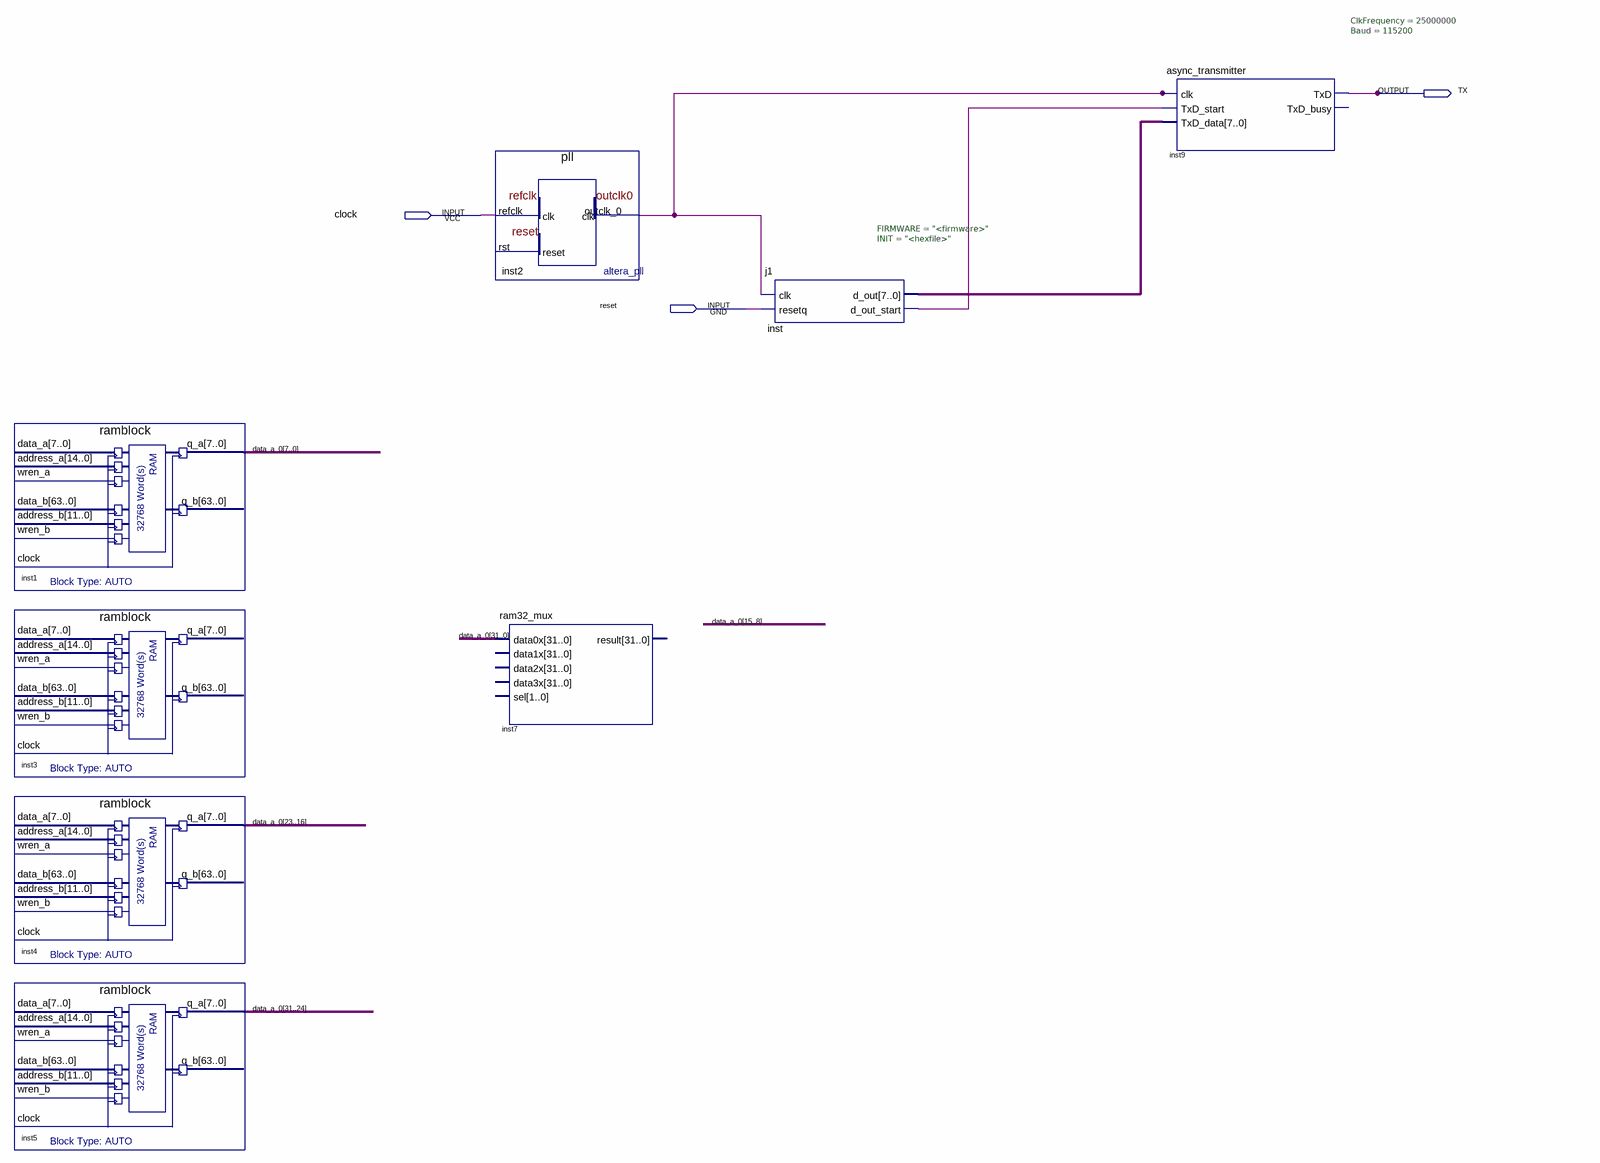
[diagram p0: schematic sheet]
// Quartus schematic top.bdf as structural Verilog: 8 symbols, 3 pins
module top (
  input  clock,
  input  reset,
  output TX
);

  wire inst2_outclk_0, inst_d_out_start;
  wire [7:0] inst_d_out;
  wire [31:0] data_a_0;

  ramblock inst1 (.q_a(data_a_0[7:0]));  // open: data_a, address_a, wren_a, data_b, address_b, wren_b, clock, q_b
  ramblock inst3 ();  // open: data_a, address_a, wren_a, data_b, address_b, wren_b, clock, q_a, q_b
  ramblock inst4 (.q_a(data_a_0[23:16]));  // open: data_a, address_a, wren_a, data_b, address_b, wren_b, clock, q_b
  ramblock inst5 (.q_a(data_a_0[31:24]));  // open: data_a, address_a, wren_a, data_b, address_b, wren_b, clock, q_b
  pll inst2 (.refclk(clock), .outclk_0(inst2_outclk_0));  // open: rst
  ram32_mux inst7 (.data0x(data_a_0));  // open: data1x, data2x, data3x, sel, result
  j1 #(.FIRMWARE("<firmware>"), .INIT("<hexfile>")) inst (
    .clk(inst2_outclk_0), .resetq(reset), .d_out(inst_d_out), .d_out_start(inst_d_out_start));
  async_transmitter #(.ClkFrequency(25000000), .Baud(115200)) inst9 (
    .clk(inst2_outclk_0), .TxD_start(inst_d_out_start), .TxD_data(inst_d_out), .TxD(TX));  // open: TxD_busy
endmodule
